# Altium schematic sheet PWM-DCBOOST-NIXIE.SchDoc: =ProjectTitle
size 209 x 297 mm; Scale: 1:1; Address1: Address1; Address2: Address2; Address3: Address3; Address4: Address4; SheetNumber: 7; SheetTotal: 9; DocumentType: Схема электрическая принципиальная
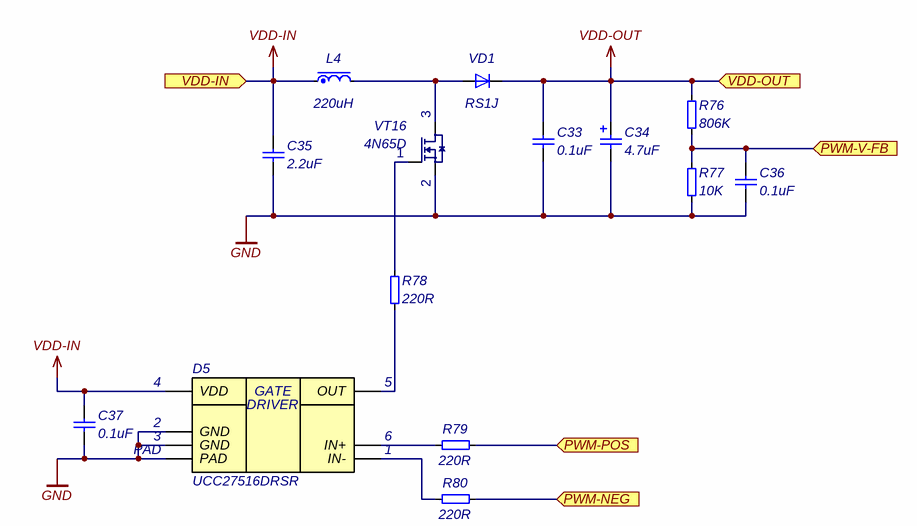
[diagram p0: PWM-DCBOOST-NIXIE.SchDoc]

## Parts
C33  0.1uF  [C1210]
C34  4.7uF  [SMD_8X10.5MM]
C35  2.2uF  [C1210]
C36  0.1uF  [C0402]
C37  0.1uF  [C0402]
D5  UCC27516DRSR  [S-PWSON-N6]
L4  220uH  [CDRH127]
R76  806K  [R_0805]
R77  10K  [R_0805]
R78  220R  [R_0402]
R79  220R  [R_0402]
R80  220R  [R_0402]
VD1  RS1J  [SMA]
VT16  4N65D  [TO-252-2L]

## Ports
PWM-NEG (in), PWM-POS (in), PWM-V-FB (in), VDD-IN (in), VDD-OUT (in)

## Nets
GND: C33.2 C34.2 C35.2 C36.2 C37.2 D5.2(GND) D5.3(GND) D5.PAD R77.2 VT16.2(S)
VDD-IN: C35.1 C37.1 D5.4(VDD) L4.1 ; port VDD-IN
VDD-OUT: C33.1 C34.1 R76.1 VD1.1(K) ; port VDD-OUT
PWM-NEG: R80.2 ; port PWM-NEG
PWM-POS: R79.2 ; port PWM-POS
PWM-V-FB: C36.1 R76.2 R77.1 ; port PWM-V-FB
NetD5_1: D5.1(IN-) R80.1
NetD5_5: D5.5(OUT) R78.2
NetD5_6: D5.6(IN+) R79.1
NetL4_2: L4.2 VD1.2(A) VT16.3(D)
NetR78_1: R78.1 VT16.1(G)

## Notes on the sheet
- Подп. и дата
- Инв. № дубл.
- Взам. инв. №
- Symbol name: =SheetSymbolDesignator
  File name: =DocumentName
  Variant name (Short): =ProjectVariant ( =ProjectBoardVariant )
  Version on board: =ProjectRevisionCode
- Инв. № подл.
- Изм.
- Лист
- № докум.
- Подп.
- Дата
- 2.106-A4
- Копировал
- Формат А4
- (in symbol UCC27516DRSR) GATE; DRIVER

## Library data of the parts
C33 = 1210-X7R-250V-0.1uF±10%: Manufacturer: Yageo; NameFromManufacturer: CC1210KKX7RYBB104; Place: S; Voltage: 250V; Tolerance: 10%; Check: False; Part Number: 1210-X7R-250V-0.1uF±10%; Value: 0.1uF; Temperature: -55°C~125°C; ComponentLink2Description: Link to datasheet; ComponentLink1Description: DATASHEET; ComponentLink2URL: https://www.electronshik.ru/item/YAG/CC1210KKX7RYBB104; ComponentLink1URL: Datasheets/capacitors/UPY-GPHC_X7R_6.3V-to-250V_22.pdf#Datasheets/capacitors/UPY-GPHC_X7R_6.3V-to-250V_22.pdf#; Last changed: 15.11.2022
C34 = ECAPSMD-4.7UF-400V-20%-10000h: *; Manufacturer: Ymin; NameFromManufacturer: VKMD1002G4R7MV; Place: T; Voltage: 400V; Tolerance: 20%; Check: False; Part Number: ECAPSMD-4.7UF-400V-20%-10000h; Value: 4.7uF; Temperature: -40°C~105°C; ComponentLink2Description: Link to datasheet; ComponentLink1Description: DATASHEET; ComponentLink2URL: https://www.lcsc.com/product-detail/Aluminum-Electrolytic-Capacitors-SMD_Ymin-VKMD1002G4R7MV_C487561.html; Last changed: 21.01.2024
C35 = 1210-X7R-100V-2.2uF±10%: Manufacturer: Samsung Electro-Mechanics; NameFromManufacturer: CL32B225KCJSNNE; Place: S; Voltage: 100V; Tolerance: 10%; Check: False; Part Number: 1210-X7R-100V-2.2uF±10%; Value: 2.2uF; Temperature: -55°C~125°C; ComponentLink2Description: Link to datasheet; ComponentLink1Description: DATASHEET; ComponentLink2URL: https://www.digikey.com/en/products/detail/samsung-electro-mechanics/CL32B225KCJSNNE/3889020; ComponentLink1URL: Datasheets/capacitors/samsung_cl32b225kcjsnne.pdf; Last changed: 27.10.2022
C36 C37 = 0402-X7R-16V-0.1uF±10%: Manufacturer: Yageo; NameFromManufacturer: CC0402JRX7R7BB104; Place: S; Voltage: 16V; Tolerance: 10%; Check: False; Part Number: 0402-X7R-16V-0.1uF±10%; Value: 0.1uF; Temperature: -55°C~125°C; ComponentLink2Description: Link to datasheet; ComponentLink1Description: DATASHEET; ComponentLink2URL: https://www.yageo.com/upload/media/product/productsearch/datasheet/mlcc/UPY-GPHC_X7R_6.3V-to-50V_18.pdf; ComponentLink1URL: Datasheets/capacitors/UPY-GPHC_X7R_6.3V-to-50V_18.pdf; Last changed: 27.10.2022
D5 = UCC27516DRSR: Low Side 4.5V~18V 4A SON-6(3x3) Gate Drive; Manufacturer: Texas Instruments; Place: T; Check: False; Part Number: UCC27516DRSR; Temperature: -40°C~140°C; Value: UCC27516DRSR; ComponentLink1Description: DATASHEET; NameFromManufacturer: UCC27516DRSR; ComponentLink1URL: https://www.lcsc.com/product-detail/Gate-Drive-ICs_Texas-Instruments-UCC27516DRSR_C3655221.html; Last changed: 21.01.2024
L4 = SLH1207S-221k-1.16A: *; Manufacturer: Sunltech Tech; NameFromManufacturer: SLH1207S221MTT; Place: T; Tolerance: 20%; Current: 1.16A; DC Resistance: 0.39R; Check: False; Part Number: SLH1207S-221k-1.16A; Value: 220uH; Temperature: -40°C~125°C; ComponentLink1Description: DATASHEET; ComponentLink1URL: https://www.lcsc.com/product-detail/Power-Inductors_Sunltech-Tech-SLH1207S221MTT_C182174.html; Last changed: 21.01.2024
R76 = 0805-0.125W-806K-100ppm±1%: *; NameFromManufacturer: RC0805FR-07806KL; Manufacturer: Yageo; Place: S; Tolerance: 1%; Check: False; Part Number: 0805-0.125W-806K-100ppm±1%; Value: 806K; Temperature: -55°C~125°C; ComponentLink1Description: DATASHEET; ComponentLink1URL: https://www.terraelectronica.ru/product/871864; Datasheet: Datasheets/resistors/PYu-RC_Group_51_RoHS_L_11.pdf; Last changed: 27.10.2022
R77 = 0805-0.125W-10K-200ppm±1%: NameFromManufacturer: RC0805FR-0710KL; Manufacturer: Yageo; Place: T; Tolerance: 1%; Check: False; Part Number: 0805-0.125W-10K-200ppm±1%; Value: 10K; Temperature: -55°C~155°C; ComponentLink1Description: DATASHEET; ComponentLink1URL: https://static.chipdip.ru/lib/175/DOC011175144.pdf; Datasheet: Datasheets/resistors/PYu-RC_Group_51_RoHS_L_11.pdf; Last changed: 22.01.2024
R78-R80 = 0402-0.0625W-220R-100ppm±1%: NameFromManufacturer: RC0402FR-07220RL; Manufacturer: Yageo; Place: S; Tolerance: 1%; Check: False; Part Number: 0402-0.0625W-220R-100ppm±1%; Value: 220R; Temperature: -55°C~155°C; ComponentLink1Description: DATASHEET; ComponentLink1URL: https://octopart.com/rc0402jr-07220rl-yageo-40254879?r=sp#Specs; Datasheet: Datasheets/resistors/RC0402.pdf; Last changed: 28.03.2023
VD1 = RS1J: 600V 1.3V@1A 250ns 1A SMA(DO-214AC) Switching Diode; Manufacturer: WPMtek; Place: T; Check: False; Part Number: RS1J; Value: RS1J; Temperature: -55°C~150°C; ComponentLink1Description: DATASHEET; NameFromManufacturer: RS1J; ComponentLink1URL: https://www.lcsc.com/product-detail/Switching-Diode_WPMtek-Wei-Pan-Microelectronics-RS1J_C2766052.html; Last changed: 21.01.2024
VT16 = 4N65D: 650V 4A 2.5Ω TO-252 MOSFET / 650V 4A 2.5Ω TO-252 MOSFET; Manufacturer: MDD; NameFromManufacturer: MDD4N65D; Place: T; Check: False; Part Number: 4N65D; Voltage: 650V; Value: 4N65D; Temperature: -55°C~150°C; ComponentLink1Description: DATASHEET; ComponentLink1URL: https://www.lcsc.com/product-detail/MOSFETs_MDD-Microdiode-Electronics-MDD4N65D_C5299402.html; Last changeв: 21.01.2024